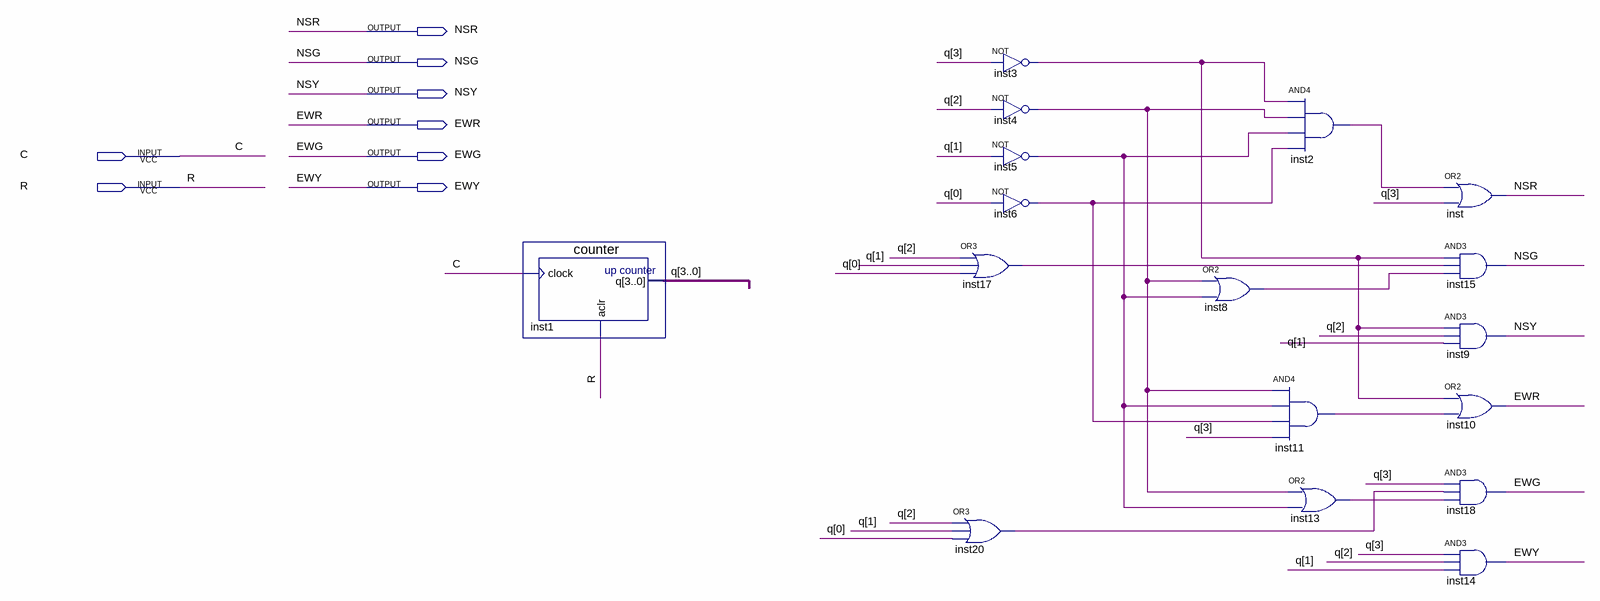
[diagram p0: schematic sheet]
// Quartus schematic circuit1.bdf as structural Verilog: 17 symbols, 8 pins
module circuit1 (
  input  C,
  input  R,
  output NSR,
  output NSG,
  output NSY,
  output EWR,
  output EWG,
  output EWY
);

  wire inst2_out, inst3_out, inst4_out, inst5_out, inst6_out, inst8_out, inst11_out, inst13_out, inst17_out,
       inst20_out;
  wire [3:0] q;

  counter inst1 (.clock(C), .aclr(R), .q(q));
  or inst17 (inst17_out, q[2], q[1], q[0]);
  or inst20 (inst20_out, q[2], q[1], q[0]);
  not inst3 (inst3_out, q[3]);
  not inst4 (inst4_out, q[2]);
  not inst5 (inst5_out, q[1]);
  not inst6 (inst6_out, q[0]);
  or inst8 (inst8_out, inst4_out, inst5_out);
  and inst11 (inst11_out, inst4_out, inst5_out, inst6_out, q[3]);
  and inst2 (inst2_out, inst3_out, inst4_out, inst5_out, inst6_out);
  or inst13 (inst13_out, inst4_out, inst5_out);
  or inst (NSR, inst2_out, q[3]);
  and inst15 (NSG, inst3_out, inst17_out, inst8_out);
  and inst9 (NSY, inst3_out, q[2], q[1]);
  or inst10 (EWR, inst3_out, inst11_out);
  and inst18 (EWG, q[3], inst20_out, inst13_out);
  and inst14 (EWY, q[3], q[2], q[1]);
endmodule
